# Altium project barun module.prjpcb
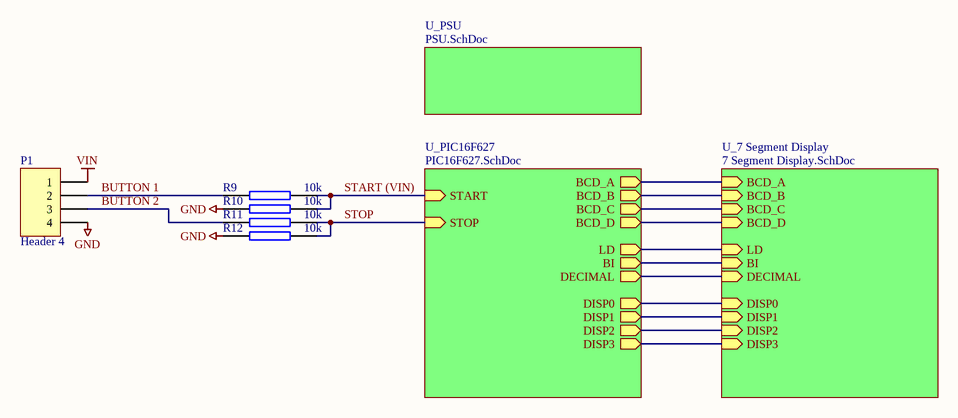
[diagram p0: Barun Module.SchDoc]
4 sheets, 29 parts. Net scope: hierarchical (ports join the sheet entries above them; power ports are global).
Board file: Barun Module.PcbDoc
Sheets:
  Barun Module.SchDoc
    U_7 Segment Display = 7 Segment Display.SchDoc
    U_PIC16F627 = PIC16F627.SchDoc
    U_PSU = PSU.SchDoc

## Sheet Barun Module.SchDoc
size A4

### Parts
P1  Header 4  [4 x 5.08mm]
R9  10k  [RES (3D) - 0603]
R10  10k  [RES (3D) - 0603]
R11  10k  [RES (3D) - 0603]
R12  10k  [RES (3D) - 0603]

### Sub-sheets
U_7 Segment Display = 7 Segment Display.SchDoc: BCD_A (in), BCD_B (in), BCD_C (in), BCD_D (in), LD (in), BI (in), DISP0 (in), DISP1 (in), DISP2 (in), DISP3 (in), DECIMAL (in)
U_PIC16F627 = PIC16F627.SchDoc: BCD_A (out), BCD_B (out), BCD_C (out), BCD_D (out), LD (out), BI (out), DISP0 (out), DISP1 (out), DISP2 (out), DISP3 (out), DECIMAL (out), START (in), STOP (in)
U_PSU = PSU.SchDoc: no entries

### Nets
GND: P1.4 R10.1 R12.1
VIN: P1.1
BCD_A: sheet U_7 Segment Display/BCD_A, sheet U_PIC16F627/BCD_A
BCD_B: sheet U_7 Segment Display/BCD_B, sheet U_PIC16F627/BCD_B
BCD_C: sheet U_7 Segment Display/BCD_C, sheet U_PIC16F627/BCD_C
BCD_D: sheet U_7 Segment Display/BCD_D, sheet U_PIC16F627/BCD_D
BI: sheet U_7 Segment Display/BI, sheet U_PIC16F627/BI
BUTTON 1: P1.2 R9.1
BUTTON 2: P1.3 R11.1
LD: sheet U_7 Segment Display/LD, sheet U_PIC16F627/LD
START (VIN): R9.2 R10.2 ; sheet U_PIC16F627/START
STOP: R11.2 R12.2 ; sheet U_PIC16F627/STOP
NetQ1_1: sheet U_7 Segment Display/DISP0, sheet U_PIC16F627/DISP0
NetQ2_1: sheet U_7 Segment Display/DISP1, sheet U_PIC16F627/DISP1
NetQ3_1: sheet U_7 Segment Display/DISP2, sheet U_PIC16F627/DISP2
NetQ4_1: sheet U_7 Segment Display/DISP3, sheet U_PIC16F627/DISP3
NetR8_1: sheet U_7 Segment Display/DECIMAL, sheet U_PIC16F627/DECIMAL

### Library data of the parts
P1 = Header 4: Header, 4-Pin; Manufacturer: Phoenix Contact; Manufacturer Part No.: 1733596; value: 4 x 5.08mm; Mouser Part no.: 651-1733596; Web link: http://au.mouser.com/ProductDetail/Phoenix-Contact/1733596/?qs=8BCRtFWWXOQoaU9FOMDU4Q%3d%3d
R9-R12 = RES SMD 0603 10k: RESISTOR SMD 0603 10k; Manufacturer: Bourns; Manufacturer Part No.: CR0603FX-1002ELF; Mouser Part no.: 652-CR0603FX-1002ELF; Web link: http://au.mouser.com/ProductDetail/Bourns/CR0603-FX-1002ELF/?qs=sGAEpiMZZMu61qfTUdNhG6LqqFhkr6pUNCm4S5639HA%3d; value: 10k

## Sheet 7 Segment Display.SchDoc
size A4
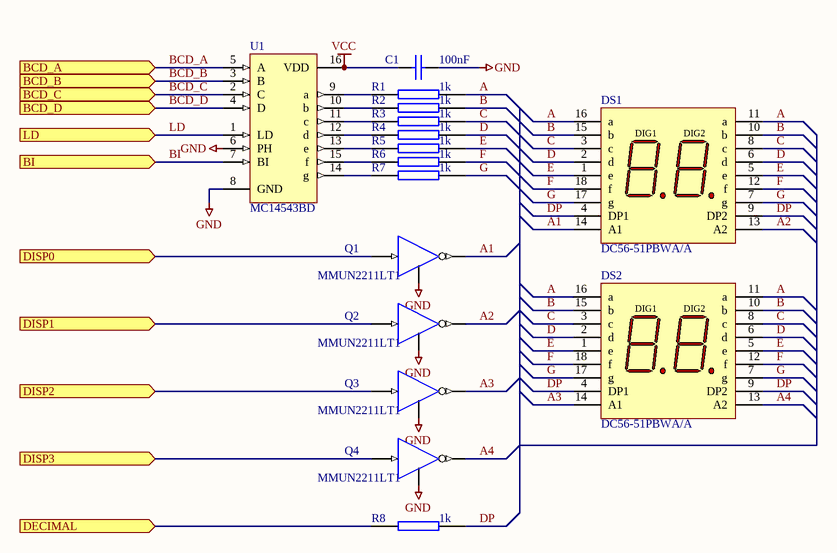
[diagram p1: 7 Segment Display.SchDoc]

### Parts
C1  100nF  [CAP (3D) - 0603]
DS1  DC56-51PBWA/A  [K-18 (3D)]
DS2  DC56-51PBWA/A  [K-18 (3D)]
Q1  MMUN2211LT1  [SOT23-3L]
Q2  MMUN2211LT1  [SOT23-3L]
Q3  MMUN2211LT1  [SOT23-3L]
Q4  MMUN2211LT1  [SOT23-3L]
R1  1k  [RES (3D) - 0603]
R2  1k  [RES (3D) - 0603]
R3  1k  [RES (3D) - 0603]
R4  1k  [RES (3D) - 0603]
R5  1k  [RES (3D) - 0603]
R6  1k  [RES (3D) - 0603]
R7  1k  [RES (3D) - 0603]
R8  1k  [RES (3D) - 0603]
U1  MC14543BD  [751B-05_N]

### Ports
BCD_A (in), BCD_B (in), BCD_C (in), BCD_D (in), BI (in), DECIMAL (in), DISP0 (in), DISP1 (in), DISP2 (in), DISP3 (in), LD (in)

### Nets
GND: C1.2 Q1.2(E) Q2.2(E) Q3.2(E) Q4.2(E) U1.6(PH) U1.8(GND)
VCC: C1.1 U1.16(VDD)
A: DS1.11(a) DS1.16(a) DS2.11(a) DS2.16(a) R1.2
A1: DS1.14(A1) Q1.3(C)
A2: DS1.13(A2) Q2.3(C)
A3: DS2.14(A1) Q3.3(C)
A4: DS2.13(A2) Q4.3(C)
B: DS1.10(b) DS1.15(b) DS2.10(b) DS2.15(b) R2.2
BCD_A: U1.5(A) ; port BCD_A
BCD_B: U1.3(B) ; port BCD_B
BCD_C: U1.2(C) ; port BCD_C
BCD_D: U1.4(D) ; port BCD_D
BI: U1.7(BI) ; port BI
C: DS1.3(c) DS1.8(c) DS2.3(c) DS2.8(c) R3.2
D: DS1.2(d) DS1.6(d) DS2.2(d) DS2.6(d) R4.2
DP: DS1.4(DP1) DS1.9(DP2) DS2.4(DP1) DS2.9(DP2) R8.2
E: DS1.1(e) DS1.5(e) DS2.1(e) DS2.5(e) R5.2
F: DS1.12(f) DS1.18(f) DS2.12(f) DS2.18(f) R6.2
G: DS1.7(g) DS1.17(g) DS2.7(g) DS2.17(g) R7.2
LD: U1.1(LD) ; port LD
NetQ1_1: Q1.1(B) ; port DISP0
NetQ2_1: Q2.1(B) ; port DISP1
NetQ3_1: Q3.1(B) ; port DISP2
NetQ4_1: Q4.1(B) ; port DISP3
NetR1_1: R1.1 U1.9(a)
NetR2_1: R2.1 U1.10(b)
NetR3_1: R3.1 U1.11(c)
NetR4_1: R4.1 U1.12(d)
NetR5_1: R5.1 U1.13(e)
NetR6_1: R6.1 U1.15(f)
NetR7_1: R7.1 U1.14(g)
NetR8_1: R8.1 ; port DECIMAL

### Notes on the sheet
- (in symbol HDSP-521A) DIG1; DIG2

### Library data of the parts
C1 = CAP SMD 0603 100nF: CAPACITOR SMD 0603; Manufacturer: Murata; Manufacturer Part No.: GCM188R71C104KA37D; Mouser Part no.: 81-GCM188R71C104KA7D; Web link: http://au.mouser.com/ProductDetail/Murata/GCM188R71C104KA37D/?qs=aEuGZpxfbxWKAxwYn%252beTMg%3d%3d; value: 100nF
DS1 DS2 = HDSP-521A: 14.22 mm 2-Digit General Purpose Blue 7-Segment Display; Manufacturer: Kingbright; Manufacturer Part No.: DC56-51PBWA/A; Mouser Part no.: 604-DC56-51PWA/A; value: DC56-51PBWA/A; Web link: http://au.mouser.com/ProductDetail/Kingbright/DC56-51PBWA-A/?qs=sGAEpiMZZMvkC18yXH9iImaSvJt1jDBMn4pTsm9NSeE%3d
Q1-Q4 = NPN DIGITAL TRANSISTOR: Manufacturer: ON Semiconductor; Manufacturer Part No.: MUN5211T1G; value: MMUN2211LT1G; Mouser Part no.: 863-MUN5211T1G; Web Link: http://au.mouser.com/ProductDetail/ON-Semiconductor/MUN5211T1G/?qs=sGAEpiMZZMt32xmUYxteed765t4s7ZSB2i30a5%252bW6aQ%3d
R1-R8 = RES SMD 0603 1k: RESISTOR SMD 0603 1k; Manufacturer: Bourns; Manufacturer Part No.: CR0603-JW-102ELF; Mouser Part no.: 652-CR0603-JW-102ELF; Web link: http://au.mouser.com/ProductDetail/Bourns/CR0603-JW-102ELF/?qs=sGAEpiMZZMu61qfTUdNhG2nPoCjtvs%252bRXTOJv8O9Kbk%3d; value: 1k
U1 = MC14543BD: BCD-to-7-Segment Latch/Decoder/Driver for Liquid Crystals; Manufacturer: TEXAS INSTRUMENTS; Manufacturer Part No.: CD4543BPWR; value: CD4543BPWR; Mouser Part no.: 595-CD4543BPWR; Web link: http://au.mouser.com/ProductDetail/Texas-Instruments/CD4543BPWR/?qs=sGAEpiMZZMtxONTBFIcRfsIzUmYcFeAD7hbzjqG8ERQ%3d

## Sheet PIC16F627.SchDoc
size A4
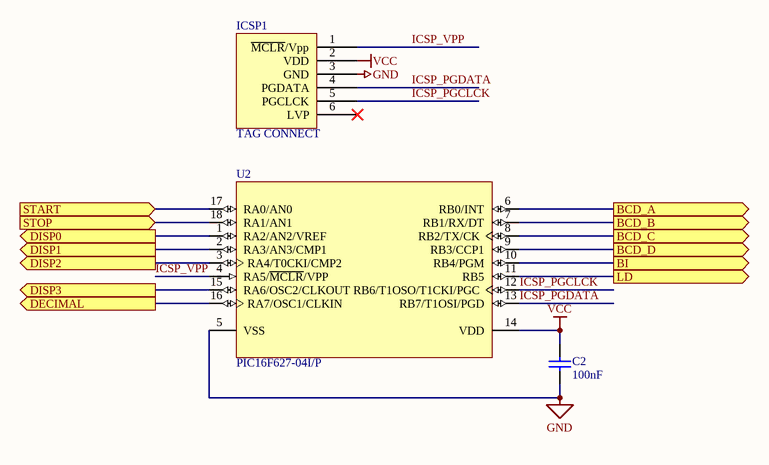
[diagram p2: PIC16F627.SchDoc]

### Parts
C2  value 100nF  [CAP (3D) - 0603]  (hidden comment: Cap)
ICSP1  TAG CONNECT  [ICSP - TAG CONNECT]
U2  PIC16F627-04I/P  [SOIC-18]

### Ports
BCD_A (out), BCD_B (out), BCD_C (out), BCD_D (out), BI (out), DECIMAL (out), DISP0 (out), DISP1 (out), DISP2 (out), DISP3 (out), LD (out), START (in), STOP (in)

### Nets
GND: C2.1 ICSP1.3(GND) U2.5(VSS)
VCC: C2.2 ICSP1.2(VDD) U2.14(VDD)
BCD_A: U2.6(RB0/INT) ; port BCD_A
BCD_B: U2.7(RB1/RX/DT) ; port BCD_B
BCD_C: U2.8(RB2/TX/CK) ; port BCD_C
BCD_D: U2.9(RB3/CCP1) ; port BCD_D
BI: U2.10(RB4/PGM) ; port BI
ICSP_PGCLCK: ICSP1.5(PGCLCK) U2.12(RB6/T1OSO/T1CKI/PGC)
ICSP_PGDATA: ICSP1.4(PGDATA) U2.13(RB7/T1OSI/PGD)
ICSP_VPP: ICSP1.1(~{MCLR}/Vpp) U2.4(RA5/~{MCLR}/VPP)
LD: U2.11(RB5) ; port LD
START (VIN): U2.17(RA0/AN0) ; port START
STOP: U2.18(RA1/AN1) ; port STOP
NetQ1_1: U2.1(RA2/AN2/VREF) ; port DISP0
NetQ2_1: U2.2(RA3/AN3/CMP1) ; port DISP1
NetQ3_1: U2.3(RA4/T0CKI/CMP2) ; port DISP2
NetQ4_1: U2.15(RA6/OSC2/CLKOUT) ; port DISP3
NetR8_1: U2.16(RA7/OSC1/CLKIN) ; port DECIMAL

Not connected (* = marked no-connect by the designer): ICSP1 6(LVP)*

### Library data of the parts
C2 = Cap: Capacitor; Manufacturer: Murata; Manufacturer Part No.: GCM188R71C104KA37D; Mouser Part No.: 81-GCM188R71C104KA7D; Web link: http://au.mouser.com/ProductDetail/Murata/GCM188R71C104KA37D/?qs=aEuGZpxfbxWKAxwYn%252beTMg%3d%3d
ICSP1 = ICSP - TAG CONNECT: Manufacturer: N/A - PCB ARTWORK; value: ICSP1; Manufacturer Part No.: N/A; Mouser Part no.: N/A; Web link: N/A
U2 = PIC16F627-04I/P: FLASH-Based 8-Bit CMOS Microcontroller, 1K (x14-Bit words) FLASH, 224 Bytes RAM, 4 MHz, 18-Pin PDIP, 3.0 to 5.5V Supply Range, Industrial Temperature; Manufacturer: MICROCHIP SEMICONDUCTOR; Value: PIC16F627A-I/SO; Mouser Part No.: 579-PIC16F627A-I/SO; Manufacturer Part No.: PIC16F627A-I/SO; Web link: http://au.mouser.com/ProductDetail/Microchip-Technology/PIC16F627A-I-SO/?qs=sGAEpiMZZMsUzhEcHltCuSCJArmd4E5f

## Sheet PSU.SchDoc
size A4
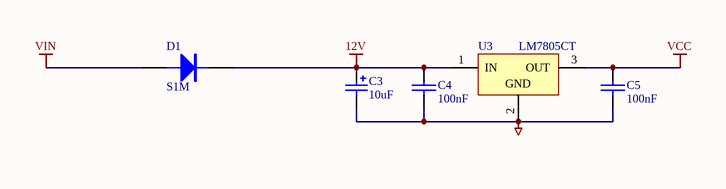
[diagram p3: PSU.SchDoc]

### Parts
C3  10uF  [TAG B CASE]
C4  100nF  [CAP (3D) - 0603]
C5  100nF  [CAP (3D) - 0603]
D1  S1M  [DO-214AC]
U3  LM7805CT  [TO-220]

### Nets
12V: C3.1 C4.1 D1.2(K) U3.1(IN)
GND: C3.2 C4.2 C5.2 U3.2(GND)
VCC: C5.1 U3.3(OUT)
VIN: D1.1(A)

### Library data of the parts
C3 = Cap Pol: CAPACITOR POLARISED TAG B CASE; Manufacturer: Vishay/Sprague; Manufacturer Part No.: 591D106X9020B2T15H; value: 10uF; Mouser Part no.: 71-591D106X9020B2T15; Web link: http://au.mouser.com/ProductDetail/Vishay-Sprague/591D106X9020B2T15H/?qs=sGAEpiMZZMuEN2agSAc2pvHIaWFtjSV0lDKOXo3DDxQ%3d
C4 C5 = CAP: CAPACITOR SMD 0603; Manufacturer: Murata; Manufacturer Part No.: GCM188R71C104KA37D; value: 100nF; Mouser Part no.: 81-GCM188R71C104KA7D; Web link: http://au.mouser.com/ProductDetail/Murata/GCM188R71C104KA37D/?qs=aEuGZpxfbxWKAxwYn%252beTMg%3d%3d
D1 = DIODE: DIODE, POWER; Manufacturer: TAIWAN SEMI; Mouser Part no.: 821-S1M; Manufacturer Part No.: S1M; value: S1M; Web link: http://au.mouser.com/ProductDetail/Taiwan-Semiconductor/S1M/?qs=sGAEpiMZZMtEwUVCuofpuOlSmRjzJonf%252bmrIm0%252bGbjE%3d
U3 = MC7805ACT: 3-Terminal Positive Fixed Voltage Regulator; Manufacturer: Fairchild Semiconductor; Mouser Part No.: 512-LM7805CT; Value: LM7805CT; Manufacturer Part No.: LM7805CT; Web link: http://au.mouser.com/ProductDetail/Fairchild-Semiconductor/LM7805CT/?qs=sGAEpiMZZMtUqDgmOWBjgPJMQlYvsHAW%252bBbwCYnQla0%3d

## Nets that join several sheets
GND: Barun Module (P1.4 R10.1 R12.1), 7 Segment Display (7 pins), PIC16F627 (C2.1 ICSP1.3 U2.5), PSU (C3.2 C4.2 C5.2 U3.2)
VCC: 7 Segment Display (C1.1 U1.16), PIC16F627 (C2.2 ICSP1.2 U2.14), PSU (C5.1 U3.3)
VIN: Barun Module (P1.1), PSU (D1.1)
BCD_A: 7 Segment Display (U1.5), PIC16F627 (U2.6)
BCD_B: 7 Segment Display (U1.3), PIC16F627 (U2.7)
BCD_C: 7 Segment Display (U1.2), PIC16F627 (U2.8)
BCD_D: 7 Segment Display (U1.4), PIC16F627 (U2.9)
BI: 7 Segment Display (U1.7), PIC16F627 (U2.10)
LD: 7 Segment Display (U1.1), PIC16F627 (U2.11)
NetQ1_1: 7 Segment Display (Q1.1), PIC16F627 (U2.1)
NetQ2_1: 7 Segment Display (Q2.1), PIC16F627 (U2.2)
NetQ3_1: 7 Segment Display (Q3.1), PIC16F627 (U2.3)
NetQ4_1: 7 Segment Display (Q4.1), PIC16F627 (U2.15)
NetR8_1: 7 Segment Display (R8.1), PIC16F627 (U2.16)
START (VIN): Barun Module (R9.2 R10.2), PIC16F627 (U2.17)
STOP: Barun Module (R11.2 R12.2), PIC16F627 (U2.18)